# Altium schematic sheet Power Supply.SchDoc: Power Supply
size A4; Organization: Gadget Sandbox; SheetNumber: 5; SheetTotal: 5; License: CC-BY-SA 3.0; Version: 0.1; Project: NeoCortex Alice
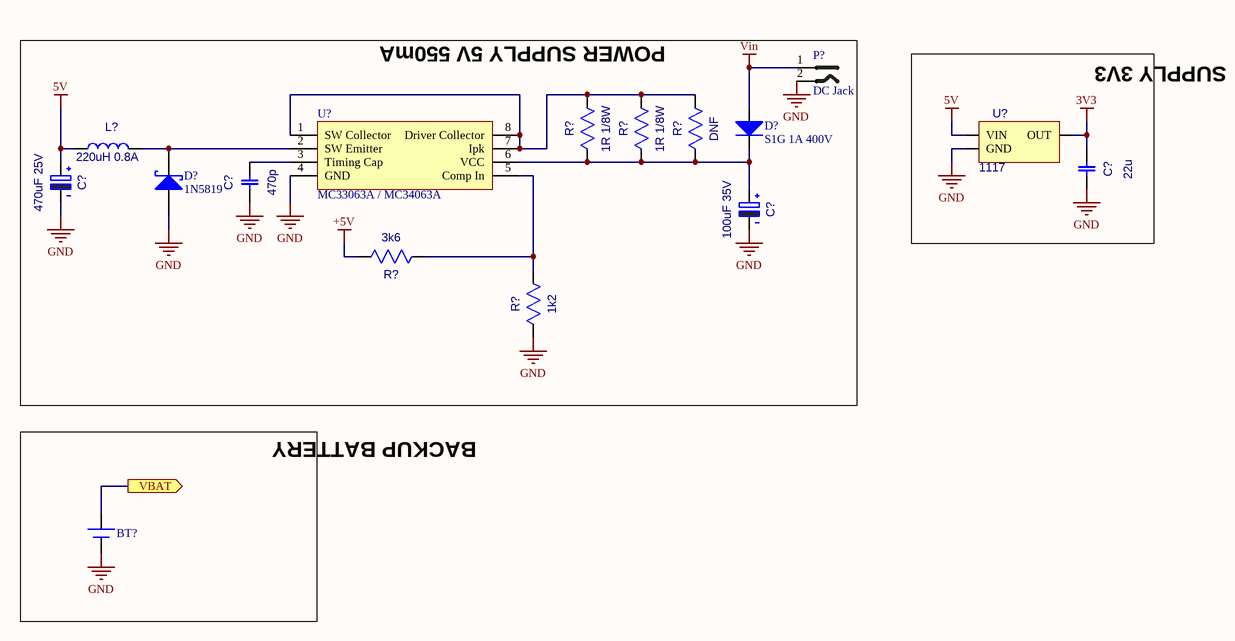
[diagram p0: Power Supply.SchDoc]

## Parts
(Parts that share a designator on the sheet are numbered #1, #2 ... from top to bottom, then left to right.)
BT?  (no value)  [Battery socket 3002]
C?#1  22u  [CAP 0805]
C?#2  470uF 25V  [CAP ELEC ALU 10mm]
C?#3  100uF 35V  [CAP ELEC ALU 10mm]
C?#4  value 470p  [CAP 0603]  (hidden comment: Capacitor Ceramic)
D?#1  S1G 1A 400V  [DO-214AC - SMA - Uni]
D?#2  1N5819  [SOD-123]
L?  220uH 0.8A  [IND SSL0804]
P?  DC Jack  [DC Jack]
R?#1  1R 1/8W  [RES 0805]
R?#2  1R 1/8W  [RES 0805]
R?#3  DNF  [RES 0805]
R?#4  3k6  [RES 0603]
R?#5  1k2  [RES 0603]
U?#1  MC33063A / MC34063A  [SOIC-8]
U?#2  1117  [SOT-223]

## Blocks framed on the sheet
POWER SUPPLY 5V 550mA: C?#2-C?#4 D?#1 D?#2 L? P? R?#1-R?#5 U?#1
SUPPLY 3V3: C?#1 U?#2
BACKUP BATTERY: BT?

## Ports
VBAT (out)

## Nets
3V3: C?#1.1 U?#2.3(OUT)
5V: C?#2.1(+) L?.1 U?#2.1(VIN)
+5V: R?#4.1
GND: BT?.2(-) C?#1.2 C?#2.2(-) C?#3.2(-) C?#4.2 D?#2.1(A) P?.2 R?#5.2 U?#1.4(GND) U?#2.2(GND)
Vin: D?#1.1(A) P?.1
VBAT: BT?.1(+) ; port VBAT
NetC?#3_1: C?#3.1(+) D?#1.2(K) R?#1.2 R?#2.2 R?#3.2 U?#1.6(VCC)
NetC?#4_1: C?#4.1 U?#1.3(Timing_Cap)
NetD?#2_2: D?#2.2(K) L?.2 U?#1.2(SW_Emitter)
NetR?#1_1: R?#1.1 R?#2.1 R?#3.1 U?#1.1(SW_Collector) U?#1.7(Ipk) U?#1.8(Driver_Collector)
NetR?#4_2: R?#4.2 R?#5.1 U?#1.5(Comp_In)

## Notes on the sheet
- Date:
- Time:
- Ver:
- Sheet
- of
- GADGET
- SANDBOX
- License:

## Library data of the parts
BT? = Battery Single: Single Cell Battery; Published: 24-Mar-1999; LatestRevisionDate: 17-Jul-2002; LatestRevisionNote: Re-released for DXP Platform.; PackageReference: BAT-2; Publisher: Altium Limited; PackageDescription: Battery; 2 Leads; RS Components: 219-7954
C?#1 = Capacitor Ceramic: Value: 22u
C?#2 C?#3 = Capacitor Electrolytic: Electrolytic Capacitor
  C?#2: Value: 470uF 25V
  C?#3: Value: 100uF 35V
D?#1 = Diode: Default Diode; Published: 8-Jun-2000; LatestRevisionDate: 17-Jul-2002; LatestRevisionNote: Re-released for DXP Platform.; PackageVersion: Sep-1996; PackageReference: SMC; Publisher: Altium Limited; PackageDescription: DO-214-AB/SMC; 2 C-Bend Leads; Body 7.9 x 5.9 mm, inc. leads (LxW); Code_JEDEC: DO-214-AB
D?#2 = Diode Schottky: Schottky; Value: BAT54-G (SOT-23); DiodesInc: 1N5819
L? = Inductor: Value: 220uH 0.8A
R?#1-R?#5 = Resistor
  R?#1 R?#2: Value: 1R 1/8W
  R?#3: Value: DNF
  R?#4: Value: 3k6
  R?#5: Value: 1k2
U?#1 = Switching Regulator: DC/DC Buck, Boost, Inv switching regulator 1.5A; Taiwan Semiconductor: TS34063CS RL; DiodesZetex: AP34063S8G-13; EXAR: SP34063AEN-L/TR; TexasInstruments: MC33063A / MC34063A
U?#2 = Regulator Positive: pin to pad: 1>3 2>1 3>2; Code: LD29080XX; Code2: MC78M00/MC78M00A; Code3: ST L78xx; Value: 1117; RS Components: 751-2890